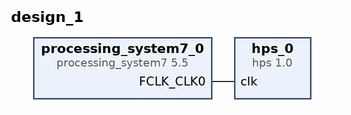
[diagram p0: block diagram of the top level]
# Vivado block design design_1, xc7z020clg484-1, Vivado 2020.2
create_bd_design design_1

create_bd_cell -type ip -vlnv xilinx.com:ip:processing_system7:5.5 processing_system7_0
create_bd_cell -type ip -vlnv xilinx.com:user:hps:1.0 hps_0

# ---- connections ----

connect_bd_net [get_bd_pins processing_system7_0/FCLK_CLK0] [get_bd_pins hps_0/clk]

validate_bd_design
save_bd_design
